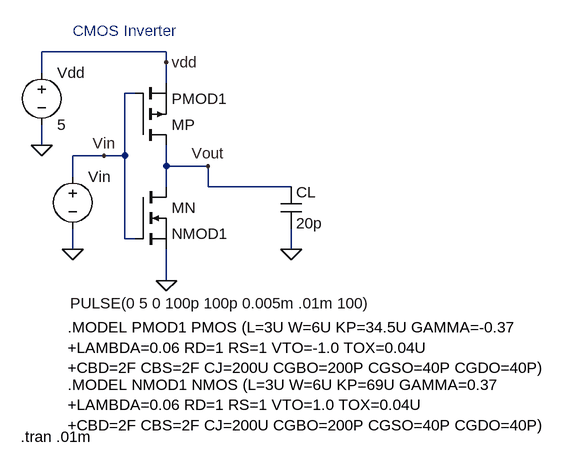
[diagram p0: schematic cmos_inv_2_2d.asc]
cmos_inv_2_2d.asc, the LTspice schematic file:
Version 4
SHEET 1 880 680
WIRE 224 -16 32 -16
WIRE 224 0 224 -16
WIRE 32 16 32 -16
WIRE 224 32 224 0
WIRE 176 48 160 48
WIRE 32 128 32 96
WIRE 128 144 80 144
WIRE 160 144 160 48
WIRE 160 144 128 144
WIRE 224 160 224 128
WIRE 288 160 224 160
WIRE 80 176 80 144
WIRE 224 192 224 160
WIRE 288 192 288 160
WIRE 416 192 288 192
WIRE 160 272 160 144
WIRE 176 272 160 272
WIRE 80 288 80 256
WIRE 416 288 416 256
WIRE 224 336 224 288
FLAG 224 336 0
FLAG 80 288 0
FLAG 32 128 0
FLAG 128 144 Vin
FLAG 288 160 Vout
FLAG 416 288 0
FLAG 224 0 vdd
SYMBOL pmos 176 128 M180
SYMATTR InstName MP
SYMATTR Value PMOD1
SYMBOL nmos 176 192 R0
SYMATTR InstName MN
SYMATTR Value NMOD1
SYMBOL voltage 80 160 R0
WINDOW 3 -4 211 Left 2
WINDOW 123 0 0 Left 0
WINDOW 39 0 0 Left 0
SYMATTR Value PULSE(0 5 0 100p 100p 0.005m .01m 100)
SYMATTR InstName Vin
SYMBOL voltage 32 0 R0
SYMATTR InstName Vdd
SYMATTR Value 5
SYMBOL cap 400 192 R0
SYMATTR InstName CL
SYMATTR Value 20p
TEXT 80 -48 Left 2 ;CMOS Inverter
TEXT 72 408 Left 2 !.MODEL PMOD1 PMOS (L=3U W=6U KP=34.5U GAMMA=-0.37\n+LAMBDA=0.06 RD=1 RS=1 VTO=-1.0 TOX=0.04U\n+CBD=2F CBS=2F CJ=200U CGBO=200P CGSO=40P CGDO=40P)
TEXT 72 496 Left 2 !.MODEL NMOD1 NMOS (L=3U W=6U KP=69U GAMMA=0.37\n+LAMBDA=0.06 RD=1 RS=1 VTO=1.0 TOX=0.04U\n+CBD=2F CBS=2F CJ=200U CGBO=200P CGSO=40P CGDO=40P)
TEXT 0 576 Left 2 !.tran .01m

The netlist it stands for:
* cmos_inv_2_2d.asc
MP Vout Vin vdd vdd PMOD1
MN Vout Vin 0 0 NMOD1
Vin Vin 0 PULSE(0 5 0 100p 100p 0.005m .01m 100)
Vdd vdd 0 5
CL Vout 0 20p
.model NMOS NMOS
.model PMOS PMOS
.lib standard.mos
* CMOS Inverter
.MODEL PMOD1 PMOS (L=3U W=6U KP=34.5U GAMMA=-0.37
+LAMBDA=0.06 RD=1 RS=1 VTO=-1.0 TOX=0.04U
+CBD=2F CBS=2F CJ=200U CGBO=200P CGSO=40P CGDO=40P)
.MODEL NMOD1 NMOS (L=3U W=6U KP=69U GAMMA=0.37
+LAMBDA=0.06 RD=1 RS=1 VTO=1.0 TOX=0.04U
+CBD=2F CBS=2F CJ=200U CGBO=200P CGSO=40P CGDO=40P)
.tran .01m
.backanno
.end

* Results of the author's LTspice run, read from the files saved beside the schematic
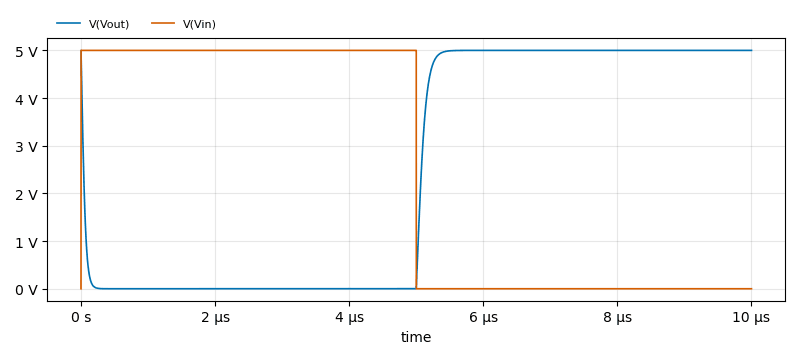
[diagram p1: Transient Analysis of cmos_inv_2_2d.asc, plotted from the saved traces]
* Transient Analysis, 1 run:
*   V(Vout): min -1.168 mV, max 5.001 V, average 2.476 V, rms 3.495 V, last 5 V
*   V(Vin): min 0 V, max 5 V, average 2.5 V, rms 3.536 V, last 0 V